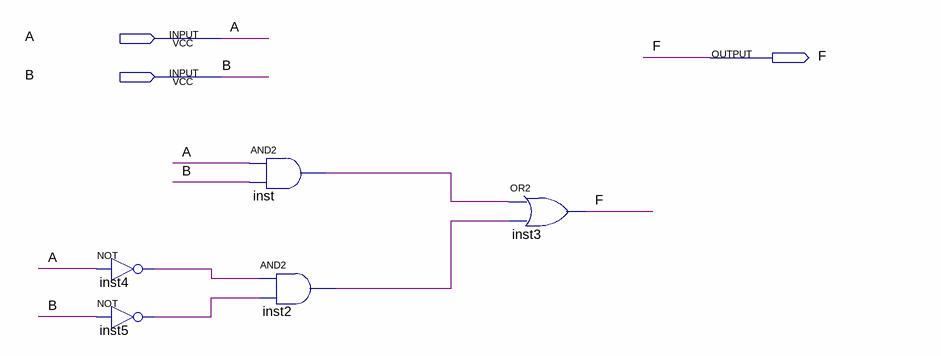
[diagram p0: schematic sheet]
// Quartus schematic lab1.bdf as structural Verilog: 5 symbols, 3 pins
module lab1 (
  input  A,
  input  B,
  output F
);

  wire inst2_out, inst4_out, inst5_out, inst_out;

  not inst4 (inst4_out, A);
  not inst5 (inst5_out, B);
  and inst (inst_out, A, B);
  and inst2 (inst2_out, inst4_out, inst5_out);
  or inst3 (F, inst_out, inst2_out);
endmodule
